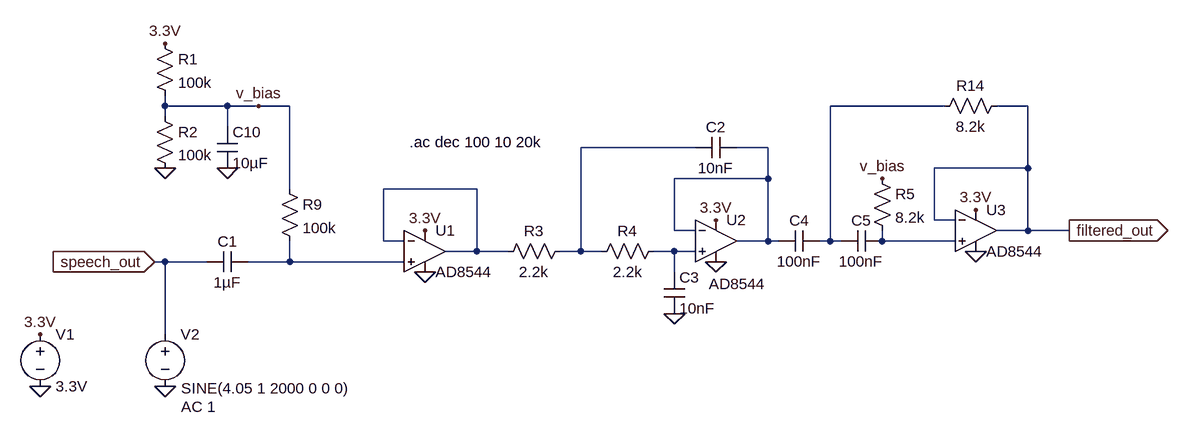
[diagram p0: schematic speech_filter.asc]
speech_filter.asc, the LTspice schematic file:
Version 4.1
SHEET 1 2244 680
WIRE 320 -176 320 -192
WIRE 416 -176 320 -176
WIRE 464 -176 416 -176
WIRE 512 -176 464 -176
WIRE 1520 -176 1344 -176
WIRE 1648 -176 1600 -176
WIRE 320 -160 320 -176
WIRE 416 -144 416 -176
WIRE 1136 -112 960 -112
WIRE 1248 -112 1200 -112
WIRE 1648 -80 1648 -176
WIRE 1648 -80 1504 -80
WIRE 1248 -64 1248 -112
WIRE 1248 -64 1104 -64
WIRE 512 -48 512 -176
WIRE 800 -48 656 -48
WIRE 1504 0 1504 -80
WIRE 1536 0 1504 0
WIRE 1104 16 1104 -64
WIRE 1136 16 1104 16
WIRE 1648 16 1648 -80
WIRE 1648 16 1600 16
WIRE 1712 16 1648 16
WIRE 656 32 656 -48
WIRE 688 32 656 32
WIRE 1248 32 1248 -64
WIRE 1248 32 1200 32
WIRE 1264 32 1248 32
WIRE 1344 32 1344 -176
WIRE 1344 32 1328 32
WIRE 1360 32 1344 32
WIRE 1424 32 1424 16
WIRE 1536 32 1424 32
WIRE 800 48 800 -48
WIRE 800 48 752 48
WIRE 848 48 800 48
WIRE 960 48 960 -112
WIRE 960 48 928 48
WIRE 992 48 960 48
WIRE 1104 48 1072 48
WIRE 1136 48 1104 48
WIRE 320 64 304 64
WIRE 384 64 320 64
WIRE 512 64 512 32
WIRE 512 64 448 64
WIRE 688 64 512 64
WIRE 1104 80 1104 48
WIRE 320 176 320 64
FLAG 128 176 3.3V
FLAG 128 256 0
FLAG 320 256 0
FLAG 304 64 speech_out
IOPIN 304 64 In
FLAG 720 80 0
FLAG 1104 144 0
FLAG 1568 48 0
FLAG 720 16 3.3V
FLAG 1168 0 3.3V
FLAG 1568 -16 3.3V
FLAG 1712 16 filtered_out
IOPIN 1712 16 Out
FLAG 1168 64 0
FLAG 320 -272 3.3V
FLAG 320 -80 0
FLAG 416 -80 0
FLAG 464 -176 v_bias
FLAG 1424 -64 v_bias
SYMBOL voltage 128 160 R0
WINDOW 123 0 0 Left 0
WINDOW 39 0 0 Left 0
SYMATTR InstName V1
SYMATTR Value 3.3V
SYMBOL voltage 320 160 R0
WINDOW 3 25 99 Left 2
WINDOW 123 25 127 Left 2
WINDOW 39 0 0 Left 0
SYMATTR InstName V2
SYMATTR Value SINE(4.05 1 2000 0 0 0)
SYMATTR Value2 AC 1
SYMBOL cap 448 48 R90
WINDOW 0 0 32 VBottom 2
WINDOW 3 32 32 VTop 2
SYMATTR InstName C1
SYMATTR Value 1µF
SYMBOL OpAmps\\AD8544 720 -16 R0
SYMATTR InstName U1
SYMBOL res 944 32 R90
WINDOW 0 0 56 VBottom 2
WINDOW 3 32 56 VTop 2
SYMATTR InstName R3
SYMATTR Value 2.2k
SYMBOL res 1088 32 R90
WINDOW 0 0 56 VBottom 2
WINDOW 3 32 56 VTop 2
SYMATTR InstName R4
SYMATTR Value 2.2k
SYMBOL cap 1088 80 R0
SYMATTR InstName C3
SYMATTR Value 10nF
SYMBOL OpAmps\\AD8544 1168 -32 R0
WINDOW 3 -11 130 Left 2
SYMATTR InstName U2
SYMBOL OpAmps\\AD8544 1568 -48 R0
SYMATTR InstName U3
SYMBOL res 304 -288 R0
SYMATTR InstName R1
SYMATTR Value 100k
SYMBOL res 304 -176 R0
SYMATTR InstName R2
SYMATTR Value 100k
SYMBOL cap 400 -144 R0
SYMATTR InstName C10
SYMATTR Value 10µF
SYMBOL res 496 -64 R0
SYMATTR InstName R9
SYMATTR Value 100k
SYMBOL cap 1200 -128 R90
WINDOW 0 0 32 VBottom 2
WINDOW 3 32 32 VTop 2
SYMATTR InstName C2
SYMATTR Value 10nF
SYMBOL cap 1328 16 R90
WINDOW 0 0 32 VBottom 2
WINDOW 3 32 32 VTop 2
SYMATTR InstName C4
SYMATTR Value 100nF
SYMBOL cap 1424 16 R90
WINDOW 0 0 32 VBottom 2
WINDOW 3 32 32 VTop 2
SYMATTR InstName C5
SYMATTR Value 100nF
SYMBOL res 1408 -80 R0
SYMATTR InstName R5
SYMATTR Value 8.2k
SYMBOL res 1616 -192 R90
WINDOW 0 0 56 VBottom 2
WINDOW 3 32 56 VTop 2
SYMATTR InstName R14
SYMATTR Value 8.2k
TEXT 696 -120 Left 2 !.ac dec 100 10 20k

The netlist it stands for:
* speech_filter.asc
V1 3.3V 0 3.3V
V2 speech_out 0 SINE(4.05 1 2000 0 0 0) AC 1
C1 N007 speech_out 1µF
X§U1 N007 N004 3.3V 0 N004 AD8544  ; pins In+ In- V+ V- OUT
R3 N002 N004 2.2k
R4 N006 N002 2.2k
C3 N006 0 10nF
X§U2 N006 N003 3.3V 0 N003 AD8544  ; pins In+ In- V+ V- OUT
X§U3 N005 filtered_out 3.3V 0 filtered_out AD8544  ; pins In+ In- V+ V- OUT
R1 3.3V v_bias 100k
R2 v_bias 0 100k
C10 v_bias 0 10µF
R9 v_bias N007 100k
C2 N003 N002 10nF
C4 N001 N003 100nF
C5 N005 N001 100nF
R5 v_bias N005 8.2k
R14 filtered_out N001 8.2k
.ac dec 100 10 20k
.backanno
.end